# Altium schematic sheet Circuit smart socet protopype.SchDoc
size A4
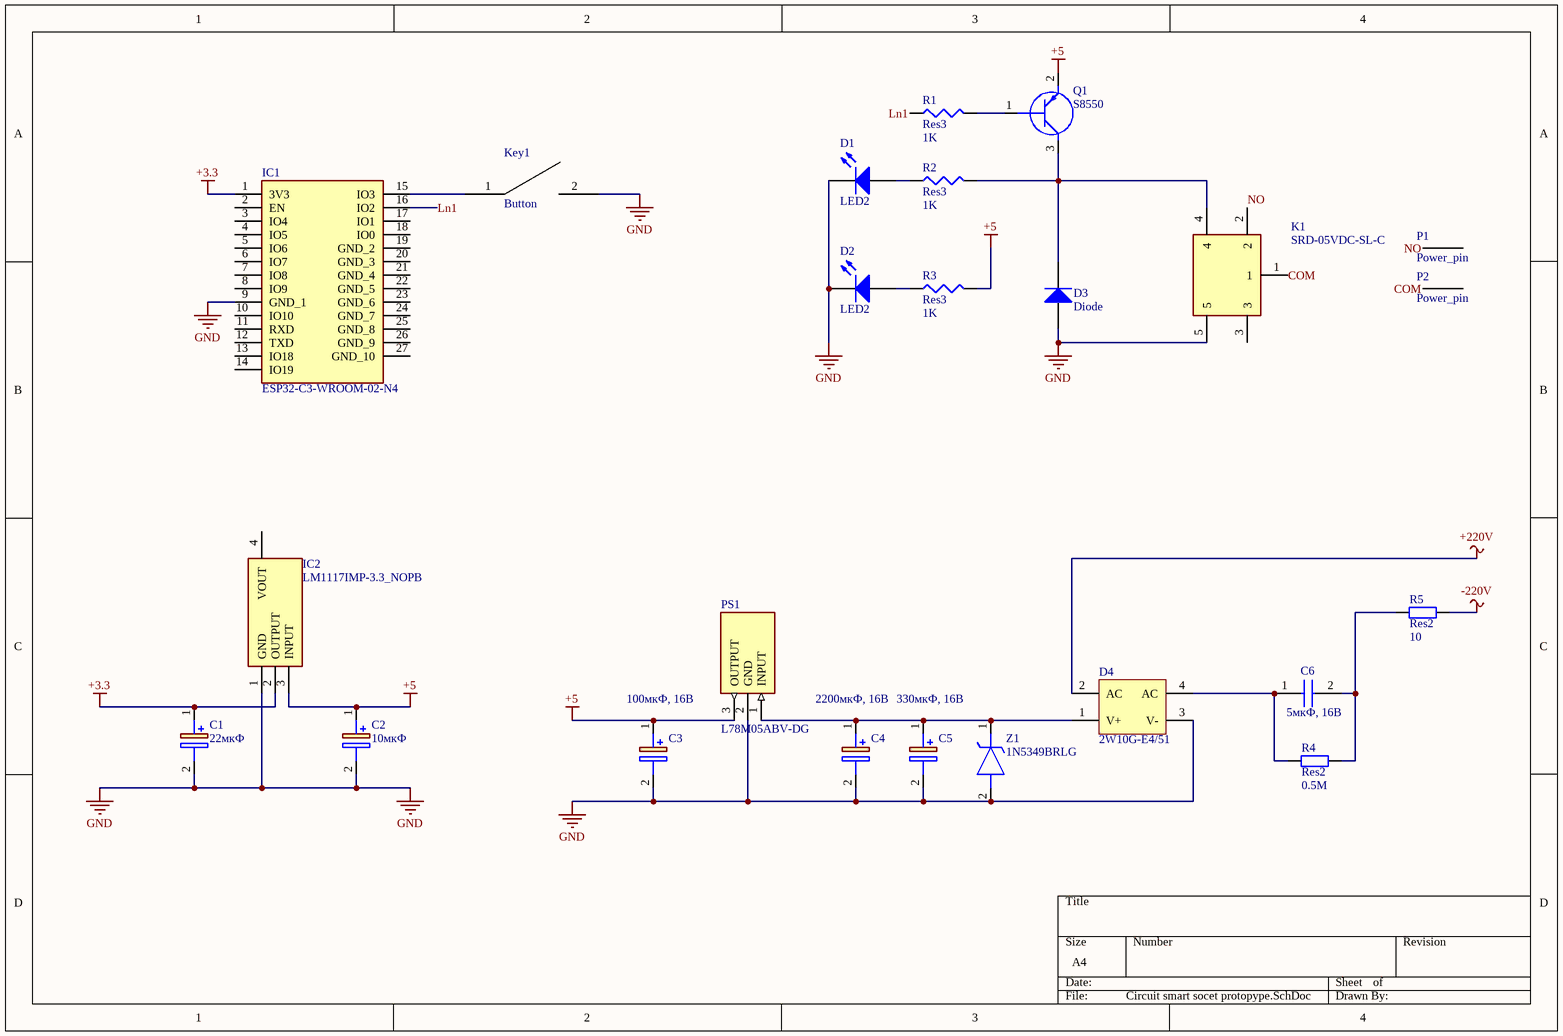
[diagram p0: Circuit smart socet protopype.SchDoc]

## Parts
C1  22мкФ  [CAPPRD250W45D655H650]
C2  10мкФ  [CAPPRD250W45D655H650]
C3  100мкФ, 16В  [CAPPRD250W45D655H650]
C4  2200мкФ, 16В  [CAPPRD250W45D655H650]
C5  330мкФ, 16В  [CAPPRD250W45D655H650]
C6  5мкФ, 16В  [MKP1G033305F00JSSD]
D1  LED2  [3.2X1.6X1.1]
D2  LED2  [3.2X1.6X1.1]
D3  Diode  [SMC]
D4  2W10G-E4/51  [D-46_6A]
IC1  ESP32-C3-WROOM-02-N4  [ESP32C3WROOM02N4]
IC2  LM1117IMP-3.3_NOPB  [SOT230P700X180-4N]
K1  SRD-05VDC-SL-C  [SRD]
Key1  Button  [Button remote]
P1  Power_pin  [Power_hole 7-3]
P2  Power_pin  [Power_hole 7-3]
PS1  L78M05ABV-DG  [TO255P460X1020X2008-3P]
Q1  S8550  [SOT95P240X115-3N]
R1  Res3  value 1K  [J1-0603]
R2  Res3  value 1K  [J1-0603]
R3  Res3  value 1K  [J1-0603]
R4  Res2  value 0.5М  [AXIAL-0.4]
R5  Res2  value 10  [AXIAL-0.4]
Z1  1N5349BRLG  [DIOAD2260W109L864D349]

## Nets
+3.3: C1.1(+) IC1.1(3V3) IC2.2(OUTPUT)
+5: C2.1(+) C3.1(+) IC2.3(INPUT) PS1.3(OUTPUT) Q1.2(E) R3.2
+220V: D4.2(AC)
-220V: R5.2
GND: C1.2(-) C2.2(-) C3.2(-) C4.2(-) C5.2(-) D1.2(K) D2.2(K) D3.1(A) D4.3(V-) IC1.9(GND_1) IC2.1(GND) K1.5 Key1.2 PS1.2(GND) Z1.2(A)
COM: K1.1 P2.1
Ln1: IC1.16(IO2) R1.1
NO: K1.2 P1.1
NetC4_1: C4.1(+) C5.1(+) D4.1(V+) PS1.1(INPUT) Z1.1(K)
NetC6_1: C6.1 D4.4(AC) R4.1
NetC6_2: C6.2 R4.2 R5.1
NetD1_1: D1.1(A) R2.1
NetD2_1: D2.1(A) R3.1
NetD3_2: D3.2(K) K1.4 Q1.3(C) R2.2
NetIC1_15: IC1.15(IO3) Key1.1
NetQ1_1: Q1.1(B) R1.2

Not connected (* = marked no-connect by the designer): IC1 2(EN) 3(IO4) 4(IO5) 5(IO6) 6(IO7) 7(IO8) 8(IO9) 10(IO10) 11(RXD) 12(TXD) 13(IO18) 14(IO19) 17(IO1) 18(IO0) 19(GND_2) 20(GND_3) 21(GND_4) 22(GND_5) 23(GND_6) 24(GND_7) 25(GND_8) 26(GND_9) 27(GND_10); IC2 4(VOUT); K1 3

## Library data of the parts
C1-C5 = 16MH5100MEFC6.3X5: Capacitor Polarised; Manufacturer_Name: Rubycon; Datasheet Link: http://www.rubycon.co.jp/en/catalog/e_pdfs/aluminum/e_mh5.pdf; Height: 6.5mm; Manufacturer_Part_Number: 16MH5100MEFC6.3X5; Mouser Part Number: 232-16MH5100MEFC63X5; Mouser Price/Stock: https://www.mouser.co.uk/ProductDetail/Rubycon/16MH5100MEFC63X5?qs=T3oQrply3y%252Bof2aeEfE49A%3D%3D
C6 = MKP1G033305F00JSSD: Capacitor; Manufacturer_Name: WIMA; Datasheet Link: https://componentsearchengine.com/Datasheets/1/MKP1G033305F00JSSD.pdf; Height: 18.5mm; Manufacturer_Part_Number: MKP1G033305F00JSSD; Mouser Part Number: 505-MKP1G033305F00JS; Mouser Price/Stock: https://www.mouser.co.uk/ProductDetail/WIMA/MKP1G033305F00JSSD?qs=OanN%252B0kfw%2FYGuQnfZtfF2A%3D%3D
D1 D2 = LED2: Typical RED, GREEN, YELLOW, AMBER GaAs LED; Published: 8-Jun-2000; LatestRevisionDate: 17-Jul-2002; LatestRevisionNote: Re-released for DXP Platform.; PackageVersion: Feb-2002; PackageReference: 3.2X1.6X1.1; Publisher: Altium Limited; PackageDescription: SM LED; 2 Flat Leads
D3 = Diode: Default Diode; Published: 8-Jun-2000; LatestRevisionDate: 17-Jul-2002; LatestRevisionNote: Re-released for DXP Platform.; PackageVersion: Sep-1996; PackageReference: SMC; Publisher: Altium Limited; PackageDescription: DO-214-AB/SMC; 2 C-Bend Leads; Body 7.9 x 5.9 mm, inc. leads (LxW); Code_JEDEC: DO-214-AB
D4 = Bridge2: Diode Bridge; Published: 24-Mar-1999; LatestRevisionDate: 17-Jul-2002; LatestRevisionNote: Re-released for DXP Platform.; PackageReference: D-46_6A; Publisher: Altium Limited; PackageDescription: Bridge Rectifier; 4 Terminals; Body 16.8 x 16.8 mm (typ); Pitch 10.67 mm
IC1 = ESP32-C3-WROOM-02-N4: Integrated Circuit; Manufacturer_Name: Espressif Systems; Datasheet Link: https://www.mouser.ch/datasheet/2/891/Espressif_ESP32_C3_WROOM_02-2006871.pdf; Height: 3.35mm; Manufacturer_Part_Number: ESP32-C3-WROOM-02-N4; Mouser Part Number: 356-ESP32C3WROOM02N4; Mouser Price/Stock: https://www.mouser.co.uk/ProductDetail/Espressif-Systems/ESP32-C3-WROOM-02-N4?qs=stqOd1AaK7%2FqjTZKEOgfUg%3D%3D
IC2 = LM1117IMP-3.3_NOPB: Integrated Circuit; Manufacturer_Name: Texas Instruments; Manufacturer_Part_Number: LM1117IMP-3.3/NOPB; Datasheet Link: https://www.ti.com/lit/ds/symlink/lm1117.pdf?ts=1607578196475&ref_url=https%253A%252F%252Fwww.google.com%252F; Height: 1.8mm; Mouser Part Number: 926-LM1117IMP3.3NOPB; Mouser Price/Stock: https://www.mouser.co.uk/ProductDetail/Texas-Instruments/LM1117IMP-33-NOPB?qs=X1J7HmVL2ZFbpN1TgOsjYQ%3D%3D; Arrow Part Number: LM1117IMP-3.3/NOPB; Arrow Price/Stock: https://www.arrow.com/en/products/lm1117imp-3.3nopb/texas-instruments?region=nac
K1 = SRD-05VDC-SL-C: Relay or Contactor; Manufacturer_Name: Songle Relay; Datasheet Link: http://files.microjpm.webnode.com/200001010-dda41de9e1/Songle%20Relay%20Datasheet.pdf; Manufacturer_Part_Number: SRD-05VDC-SL-C
PS1 = L78M05ABV-DG: Power Supply; Manufacturer_Name: STMicroelectronics; Datasheet Link: https://componentsearchengine.com/Datasheets/1/L78M05ABV-DG.pdf; Height: 4.6mm; Manufacturer_Part_Number: L78M05ABV-DG; Mouser Part Number: 511-L78M05ABV-DG; Mouser Price/Stock: https://www.mouser.co.uk/ProductDetail/STMicroelectronics/L78M05ABV-DG?qs=WHlX%252B%252B9%2FRwDCteR6J2ExhA%3D%3D; Arrow Part Number: L78M05ABV-DG; Arrow Price/Stock: https://www.arrow.com/en/products/l78m05abv-dg/stmicroelectronics?region=europe
Q1 = S8550: Transistor BJT PNP; Manufacturer_Name: Changjiang Electronics Tech (CJ); Datasheet Link: https://datasheet.lcsc.com/szlcsc/Changjiang-Electronics-Tech-CJ-S8550_C105432.pdf; Height: 1.15mm; Manufacturer_Part_Number: S8550
R1-R3 = Res3: Resistor; Published: 8-Jun-2000; LatestRevisionDate: 29-May-2009; LatestRevisionNote: IPC-7351 Footprint Added.; PackageReference: J1-0603; Publisher: Altium Limited; PackageDescription: Chip Resistor
R4 R5 = Res2: Resistor; Published: 8-Jun-2000; LatestRevisionDate: 17-Jul-2002; LatestRevisionNote: Re-released for DXP Platform.; PackageReference: AXIAL-0.4; Publisher: Altium Limited; PackageDescription: Axial Device, Thru-Hole; 2 Leads; 0.4 in Pin Spacing
Z1 = 1N5349BRLG: Zener Diode; Manufacturer_Name: ON Semiconductor; Datasheet Link: https://datasheet.datasheetarchive.com/originals/distributors/SFDatasheet-3/sf-00075052.pdf; Manufacturer_Part_Number: 1N5349BRLG; Mouser Part Number: 863-1N5349BRLG; Mouser Price/Stock: https://www.mouser.co.uk/ProductDetail/onsemi/1N5349BRLG?qs=y2kkmE52mdPPPvJa3zV6XA%3D%3D; Arrow Part Number: 1N5349BRLG; Arrow Price/Stock: https://www.arrow.com/en/products/1n5349brlg/on-semiconductor?region=nac